# Altium schematic sheet Digital_Encoder_Breakout.SchDoc
size A4
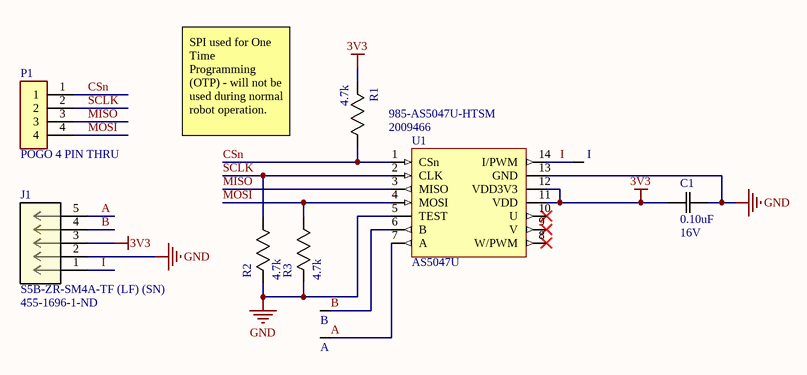
[diagram p0: Digital_Encoder_Breakout.SchDoc]

## Parts
A  Test Point (Via)  [TP]  (value not drawn)
B  Test Point (Via)  [TP]  (value not drawn)
C1  Rating: 16V  [0603]  (hidden comment: 0.10uF)
I  Test Point (Via)  [TP]  (value not drawn)
J1  S5B-ZR-SM4A-TF (LF) (SN)  Supplier Part Number 1: 455-1696-1-ND  [CONN_S5B-ZR-SM4A-TF_JST]
P1  POGO 4 PIN THRU  [POGO 4 PIN THRU]
R1  4.7k  [0603]
R2  4.7k  [0603]
R3  4.7k  [0603]
U1  AS5047U  Supplier Part Number 1: 2009466  Supplier Part Number 2: 985-AS5047U-HTSM  [AS5047U]

## Nets
3V3: C1.1(C1) J1.3 R1.2(R2) U1.11(VDD) U1.12(VDD3V3)
GND: C1.2(C2) J1.2 R2.2(R2) R3.2(R2) U1.5(TEST) U1.13(GND)
A: A.1 J1.5 U1.7(A)
B: B.1 J1.4 U1.6(B)
CSn: P1.1 R1.1(R1) U1.1(CSn)
I: I.1 J1.1 U1.14(I/PWM)
MISO: P1.3 U1.3(MISO)
MOSI: P1.4 R3.1(R1) U1.4(MOSI)
SCLK: P1.2 R2.1(R1) U1.2(CLK)

Not connected (* = marked no-connect by the designer): U1 8(W/PWM)* 9(V)* 10(U)*

## Notes on the sheet
- SPI used for One Time Programming (OTP) - will not be used during normal robot operation.

## Library data of the parts
C1 = CAP 0.10uF 16V: CAP CER 0.10UF 16V X5R 0603/0805; Tolerance: 10%; Package: 0603/0805; Temperature Coefficient: X5R; Operating Temperature: -55°C ~ 85°C; Value: 0.10uF
J1 = CN 4POS JST ZH: Connector Header Surface Mount, Right Angle 5 position 0.059" (1.50mm); Mfr_Name: JST; Copyright: Copyright (C) 2021 Ultra Librarian. All rights reserved.; Manufacturer_Part_Number: S5B-ZR-SM4A-TF (LF) (SN); Digi-Key_Part_Number_1: 455-1696-2-ND; Digi-Key_Part_Number_2: 455-1696-1-ND; Digi-Key_Part_Number_3: 455-1696-6-ND; RefDes: RefDes; Type: DEV; Supplier 1: Digi-Key
P1 = POGO 4 PIN THRU: 4 pin POGO Holes 0.100" Pitch; ComponentLink1Description: POGO Pins; ComponentLink1URL: https://www.digikey.ca/en/products/detail/mill-max-manufacturing-corp/816-22-004-10-001101/6149707?utm_adgroup=Rectangular%20Connectors%20-%20Spring%20Loaded&utm_source=google&utm_medium=cpc&utm_campaign=Shopping_Product_Connectors%2C%20Interconnects&utm_term=&productid=6149707&gclid=CjwKCAjwyIKJBhBPEiwAu7zllx5RKB49Aiz1Tcq0lCLtxeAJbHB79ZaevgMe56kl4rzAjPwbrhvRoBoC1QsQAvD_BwE
R1-R3 = RES 4.7k 1/8W - 5%: RES SMD 4.7k OHM 5% 1/8W 0805; Power (Watts): 0.125W; Package: 0805; Value: 4.7k; Tolerance: 5%
U1 = AS5047U: 14-Bit On-Axis Magnetic Rotary Position Sensor with Up to 14-Bit Binary Incremental Pulse Count; Supplier 1: RSComponents; Supplier 2: Mouser